# Altium schematic sheet Motor_Driver_DRV8313.SchDoc
size A4; CheckedBy: Jake Vidal, Noah Rondeau, Alexander Cote; DrawnBy: Alexander Cote; DocumentNumber: 2; Revision: 1.3; SheetNumber: 2; SheetTotal: 5
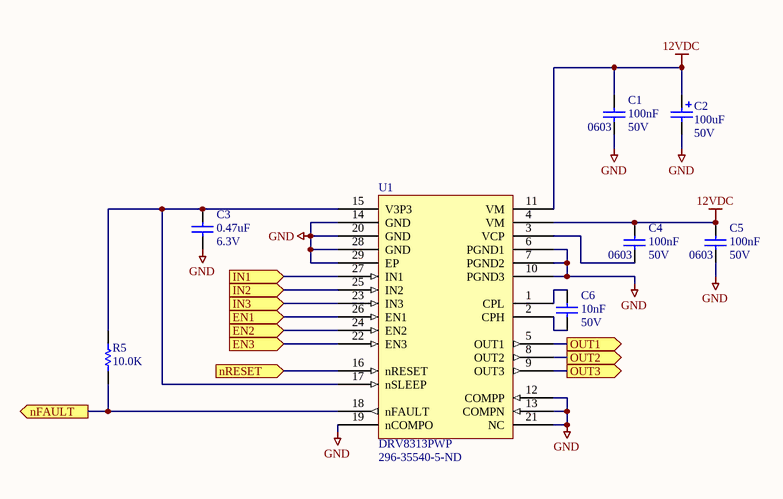
[diagram p0: Motor_Driver_DRV8313.SchDoc]

## Parts
C1  100nF  Case Code (Imperial): 0603  Voltage Rating: 50V  [CAPC1608N(0603")]
C2  100uF  Voltage: 50V  [CAPAE10083X105M]
C3  0.47uF  Voltage: 6.3V  [CAPC1608N(0603")]
C4  100nF  Case Code (Imperial): 0603  Voltage Rating: 50V  [CAPC1608N(0603")]
C5  100nF  Case Code (Imperial): 0603  Voltage Rating: 50V  [CAPC1608N(0603")]
C6  10nF  Voltage: 50V  [CAPC1608N(0603")]
R5  10.0K  [RESC1608N(0603")]
U1  DRV8313PWP  Supplier Part Number 1: 296-35540-5-ND  [HTSSOP-28]

## Ports
EN1 (in), EN2 (in), EN3 (in), IN1 (in), IN2 (in), IN3 (in), nFAULT (out), nRESET (in), OUT1 (out), OUT2 (out), OUT3 (out)

## Nets
12VDC: C1.2 C2.1 C4.2 C5.2 U1.4(VM) U1.11(VM)
GND: C1.1 C2.2 C3.2 C5.1 U1.6(PGND1) U1.7(PGND2) U1.10(PGND3) U1.12(COMPP) U1.13(COMPN) U1.14(GND) U1.19(nCOMPO) U1.20(GND) U1.21(NC) U1.28(GND) U1.29(EP)
EN1: U1.26(EN1) ; port EN1
EN2: U1.24(EN2) ; port EN2
EN3: U1.22(EN3) ; port EN3
IN1: U1.27(IN1) ; port IN1
IN2: U1.25(IN2) ; port IN2
IN3: U1.23(IN3) ; port IN3
nFAULT: R5.1 U1.18(nFAULT) ; port nFAULT
nRESET: U1.16(nRESET) ; port nRESET
OUT1: U1.5(OUT1) ; port OUT1
OUT2: U1.8(OUT2) ; port OUT2
OUT3: U1.9(OUT3) ; port OUT3
NetC3_1: C3.1 R5.2 U1.15(V3P3) U1.17(nSLEEP)
NetC4_1: C4.1 U1.3(VCP)
NetC6_1: C6.1 U1.2(CPH)
NetC6_2: C6.2 U1.1(CPL)

## Library data of the parts
C1 C4 C5 = CL10B104KB8SFNC: CAP CER 0.1UF 50V X7R 0603; Manufacturer: Samsung; Tolerance: 10%; Supplier 1: Digi-Key; Manufacturer Part Number: CL10B104KB8SFNC; Stock 1: 1859763; Pricing 1: 1 = 0.10000, 10 = 0.02900, 100 = 0.01300, 500 = 0.00928, 1000 = 0.00729 (USD); RoHS: Yes; Mount: Surface Mount; Case/Package: 0603; Case Code (Metric): 1608; Contact Plating: Tin; Min Operating Temperature: -55°C; Max Operating Temperature: 125°C; Package Quantity: 4000; Packaging: Tape and Reel; Capacitance: 100nF; Dielectric: X7R; Features: Soft Termination; Length: 1.6mm; Height: 0.8mm; Width: 0.031inch; Thickness: 0.035inch; Depth: 0.8mm; Radiation Hardening: No; Lead Free: Lead Free; ComponentLink1URL: https://datasheet.ciiva.com/25714/cl10b104kb8sfnc-25714514.pdf?src-supplier=Digi-Key; ComponentLink1Description: https://datasheet.ciiva.com/25714/cl10b104kb8sfnc-25714514.pdf?src-supplier=Digi-Key; Supplier Part Number 1: 1276-1936-1-ND
C2 = 100uF 50V, SMD, Alum, Polarized: Capacitor, Polarized, Aluminum, 50V, +/- 20%, SMD; Mfg#: EEE-1HA101UP; Mfg: Panasonic; Published: 2017-11-16; LatestRevisionDate: 2017-11-16; Publisher: UVic AERO, Taylor Long; PackageDescription: Radial, Can - SMD; Value: 100uF; Supplier 1: Digi-Key; Supplier Part Number 1: PCE3917CT-ND
C3 = 0.47uF 6.3V 0603 SMD, Ceramic: Capacitor, Ceramic, 6.3V, +/- 10%, 0603 SMD, X7R; Mfg#: GRM188R70J474KA01D; Mfg: Murata Electronics North America; Published: 2017-11-16; LatestRevisionDate: 2017-11-16; Publisher: UVic AERO, Taylor Long; PackageDescription: Chip Capacitor; Value: 0.47uF; Supplier 1: Digi-Key; Supplier Part Number 1: 490-6416-1-ND
C6 = 10nF 50V 0603 SMD, Ceramic: Capacitor, Ceramic, 50V, +/- 10%, 0603 SMD, X7R; Published: March 28, 2012; Publisher: UVic AERO; PackageDescription: Chip Capacitor; Value: 10nF; Supplier 1: Digi-Key; Supplier Part Number 1: 399-1091-1-ND
R5 = 10.0K, 1%, 1/10 W, 0603 SMD: Resistor, 1%, 1/10 W, 0603 SMD, 10.0K, +/-100ppm/C, Thick Film; Power: 1/10W; Published: Jan 14, 2011; Publisher: TRAXX Automation Ltd.; PackageDescription: Chip Resistor; Value: 10.0K; Supplier 1: Digi-Key; Supplier Part Number 1: 311-10.0KHRCT-ND
U1 = DRV8313PWP: DRV8313 2.5-A Triple 1/2-H Bridge Driver; Mfg: Texas Instruments; Supplier 1: Digi-Key; LatestRevisionBy: *; LatestRevisionDate: *; LatestRevisionNote: *; Mfg#: DRV8313PWP; Published: 2017-11-16; Publisher: UVic AERO, Taylor Long; ReviewedBy: *; ReviewedDate: *; ReviewedNote: *; Verified: No